# EAGLE design TeachingInstrument_front_panel_v3 (EAGLE 9.6.2)
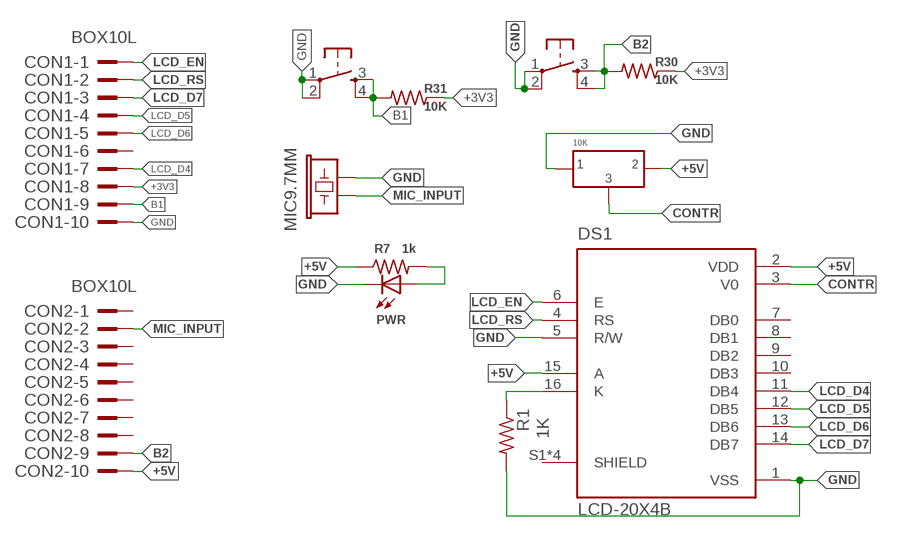
[diagram p0: schematic, sheet 1]

## Parts
CON1  BOX10L  [BOX10L]
CON2  BOX10L  [BOX10L]
DS1  LCD-20X4B  [LCD_LCD-20X4B]
PRESET  10K  PRESET_LR  [PRESET_LR]
PWR  LED3MM  [LED3MM]
R1  1K  R-US_0207/10  [0207/10]
R7  1k  R-US_0207/10  [0207/10]
R30  10K  R-US_0207/10  [0207/10]
R31  10K  R-US_0207/10  [0207/10]
U$1  OMRON_SWITCH_40-XX  [B3F-40XX]
U$2  OMRON_SWITCH_40-XX  [B3F-40XX]
U$12  MIC9.7MM  [MIC-9.7MM]

## Nets
+3V3: CON1.8 R30.1 R31.1
+5V [POWER]: CON2.10 DS1.2(VDD) DS1.15(A) PRESET.P$2 R7.1
B1: CON1.9 R31.2 U$1.3(S) U$1.4(S1)
B2: CON2.9 R30.2 U$2.3(S) U$2.4(S1)
CONTR: DS1.3(V0) PRESET.P$3
GND: CON1.10 DS1.1(VSS) DS1.5(R/W) PRESET.P$1 PWR.K(C) R1.2 U$1.1(P) U$1.2(P1) U$2.1(P) U$2.2(P1) U$12.2
LCD_D4: CON1.7 DS1.11(DB4)
LCD_D5: CON1.4 DS1.12(DB5)
LCD_D6: CON1.5 DS1.13(DB6)
LCD_D7: CON1.3 DS1.14(DB7)
LCD_EN: CON1.1 DS1.6(E)
LCD_RS: CON1.2 DS1.4(RS)
MIC_INPUT: CON2.2 U$12.1
N$2: DS1.16(K) R1.1
N$38: PWR.A R7.2
Unconnected: CON1.6 CON2.1 CON2.3 CON2.4 CON2.5 CON2.6 CON2.7 CON2.8 DS1.7(DB0) DS1.8(DB1) DS1.9(DB2) DS1.10(DB3) DS1.S1(SHIELD) DS1.S2(SHIELD) DS1.S3(SHIELD) DS1.S4(SHIELD)

## Library data of the parts
CON1 CON2 = CEDT_JANUARY_2015_v5:BOX10: 3M (TM) Pak 100 4-Wall Header Source: 3M
DS1 = LCD-20X4B:LCD-20X4B: Display Development Tools 20X4 CHARACTER BLUE LCD W/BACKLIGHT Check availability <https://pricing.snapeda.com/parts/LCD-20X4B/Gravitech/view-part?ref=eda>; AVAILABILITY: In Stock; DESCRIPTION: Display Development Tools 20X4 CHARACTER BLUE LCD W/BACKLIGHT; MF: Gravitech; MP: LCD-20X4B; PACKAGE: None; PRICE: None; PURCHASE-URL: https://pricing.snapeda.com/search/part/LCD-20X4B/?ref=eda
PRESET = CEDT_JANUARY_2015_v5:PRESET_LR
PWR = adafruit:LED: LED OSRAM: - CHIPLED LG R971, LG N971, LY N971, LG Q971, LY Q971, LO R971, LY R971 LH N974, LH R974 LS Q976, LO Q976, LY Q976 LO Q996 - Hyper CHIPLED LW Q18S LB Q993, LB Q99A, LB R99A - SideLED LS A670, LO A670, LY A670, LG A670, LP A670 LB A673, LV A673, LT A673, LW A673 LH A674 LY A675 LS A676, LA A676, LO A676, LY A676, LW A676 LS A679, LY A679, LG A679 - Hyper Micro SIDELED® LS Y876, LA Y876, LO Y876, LY Y876 LT Y87S - SmartLED LW L88C, LW L88S LB L89C, LB L89S, LG L890 LS L89K, LO L89K, LY L89K LS L896, LA L896, LO L896, LY L896 - TOPLED LS T670, LO T670, LY T670, LG T670, LP T670 LSG T670, LSP T670, LSY T670, LOP T670, LYG T670 LG T671, LOG T671, LSG T671 LB T673, LV T673, LT T673, LW T673 LH T674 LS T676, LA T676, LO T676, LY T676, LB T676, LH T676, LSB T676, LW T676 LB T67C, LV T67C, LT T67C, LS T67K, LO T67K, LY T67K, LW E67C LS E67B, LA E67B, LO E67B, LY E67B, LB E67C, LV E67C, LT E67C LW T67C LS T679, LY T679, LG T679 LS T770, LO T770, LY T770, LG T770, LP T770 LB T773, LV T773, LT T773, LW T773 LH T774 LS E675, LA E675, LY E675, LS T675 LS T776, LA T776, LO T776, LY T776, LB T776 LHGB T686 LT T68C, LB T68C - Hyper Mini TOPLED® LB M676 - Mini TOPLED Santana® LG M470 LS M47K, LO M47K, LY M47K Source: http://www.osram.convergy.de/
R1 = resistor:R-US_: RESISTOR, American symbol
R7 R30 R31 = rcl:R-US_: RESISTOR, American symbol
U$1 U$2 = CEDT_JANUARY_2015_v5:OMRON_SWITCH
U$12 = CEDT_JANUARY_2015_v5:MIC: Microphone Omni-directional electret microphone. 9.7mm standard diameter.

## Net classes
0 default: width 0.508 mm
1 POWER: width 0.61 mm, drill 0.7 mm, clearance 0.25 mm

## Board
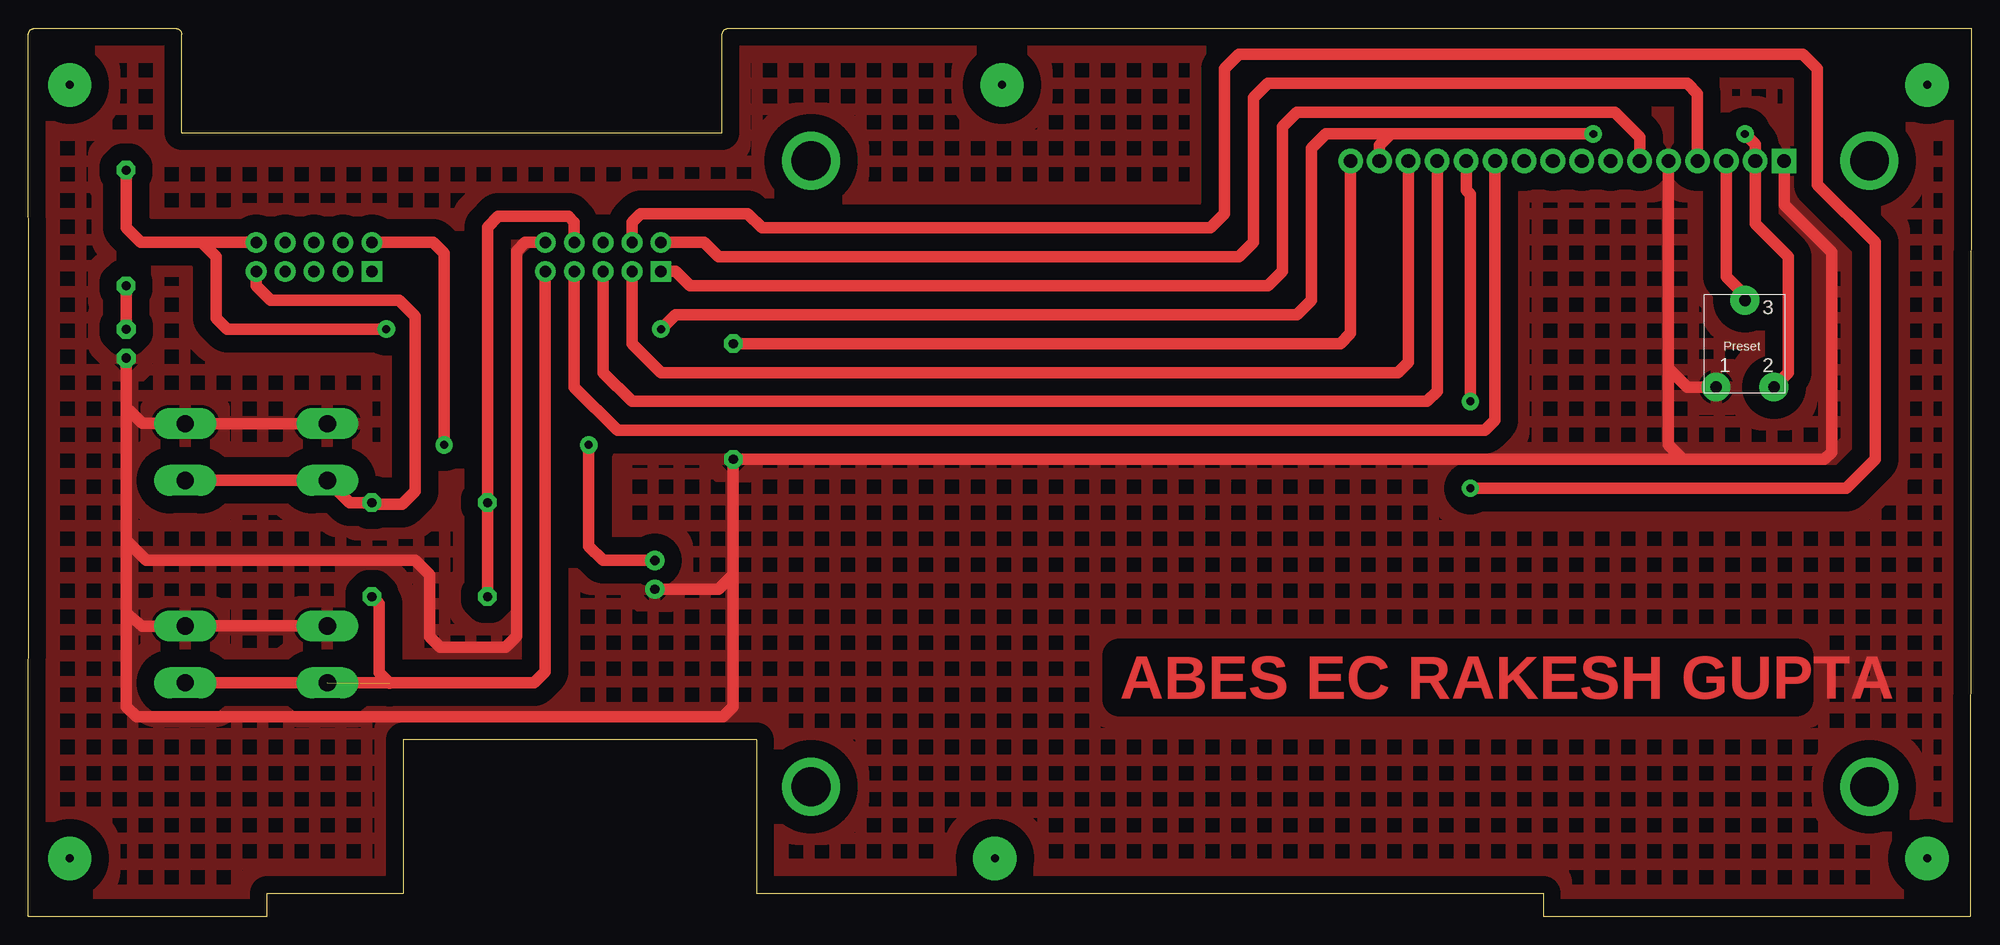
[diagram p1: board, top side]
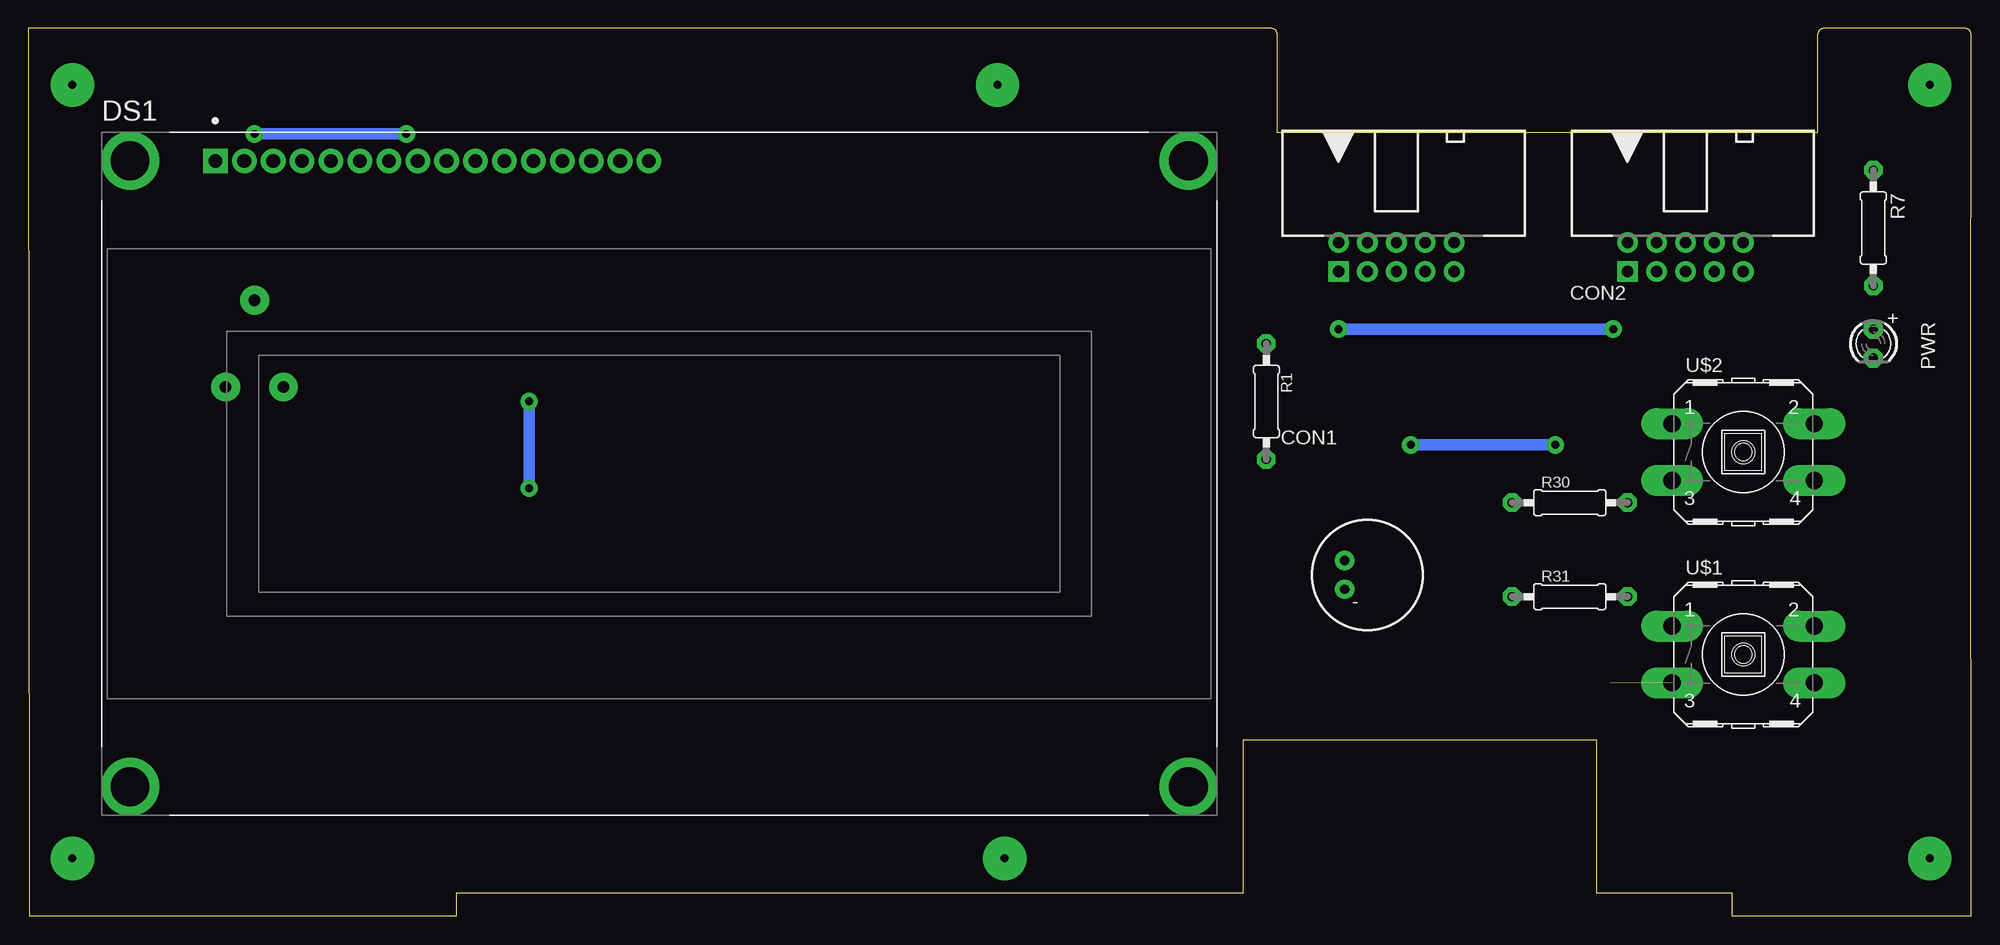
[diagram p2: board, bottom side, seen from below]

Size 170.69 x 77.98 mm. Coordinates in mm from the lower left corner, seen from the top.
Outline: 0,0 0.03,45.21 0,77.47 arc-90 0.51,77.98 12.95,77.98 arc-90 13.46,77.47 13.46,68.83 60.96,68.83 60.96,77.47 arc-90 61.47,77.98 170.69,77.98 170.64,0 133.1,0 133.1,2.01 63.96,2.01 63.96,15.51 32.94,15.51 32.94,2.01 20.98,2.01 20.98,0 0,0
Copper layers (1*16): Top 0.035mm / dielectric 1.5mm / Bottom 0.035mm
Design rules "default *": minimum track width 6mil, minimum drill 0.35mm, track to track 16mil, track to pad 16mil, pad to pad 10mil, via to via 16mil, smd to smd 16mil, copper to edge 40mil, drill to drill 6mil, minimum pad ring 16mil, minimum via ring 16mil, stop-mask expansion 4mil, vias tented up to drill 0mil, thermal gap 10mil

### Footprints (pad centres in the part's own frame; a part is rotated, then mirrored left to right if it is on the bottom)
BOX10L = drill 1 pad 1.422 square: 1 -5.08,-1.27 | drill 1 pad 1.422: 2 -5.08,1.27; 3 -2.54,-1.27; 4 -2.54,1.27; 5 0,-1.27; 6 0,1.27; 7 2.54,-1.27; 8 2.54,1.27; 9 5.08,-1.27; 10 5.08,1.27
LCD_LCD-20X4B = drill 1.2 pad 1.8 square: 1 -39,27.46 | drill 1.2 pad 1.8: 2 -36.46,27.46; 3 -33.92,27.46; 4 -31.38,27.46; 5 -28.84,27.46; 6 -26.3,27.46; 7 -23.76,27.46; 8 -21.22,27.46; 9 -18.68,27.46; 10 -16.14,27.46; 11 -13.6,27.46; 12 -11.06,27.46; 13 -8.52,27.46; 14 -5.98,27.46; 15 -3.44,27.46; 16 -0.9,27.46 | drill 3.4 pad 5.1: S1 -46.5,27.5; S2 46.5,27.5; S3 -46.5,-27.5; S4 46.5,-27.5
PRESET_LR = drill 1.016 pad 2.54: P$1 -2.54,-3.81; P$2 2.54,-3.81; P$3 0,3.81
LED3MM = drill 0.813 pad 1.676 octagon: A -1.27,0; K 1.27,0
0207/10 = drill 0.813 octagon: 1 -5.08,0; 2 5.08,0
B3F-40XX = drill 1.524 long: 1 -6.248,2.489; 2 6.248,2.489; 3 -6.248,-2.489; 4 6.248,-2.489
MIC-9.7MM = drill 0.8 pad 1.676: 1 -2,1.27; 2 -2,-1.27

### Placement (x,y rotation side)
CON1  50.5,57.91 0 bottom
CON2  25.1,57.91 0 bottom
DS1  115.27,38.86 0 bottom
PRESET  150.83,50.29 0 top
PWR  8.59,50.29 270 bottom
R1  61.93,45.21 270 bottom
R7  8.59,60.45 270 bottom
R30  35.26,36.32 0 bottom
R31  35.26,28.07 0 bottom
U$1  20.02,22.99 0 bottom
U$2  20.02,40.77 0 bottom
U$12  53.04,29.97 0 bottom

### Tracks (layer width: path | path; a pad name or v marks a point on that pad's centre or on a via)
+3V3
  Top 1.016: R31.1 R30.1 40.34,60.53 41.27,61.47 47.45,61.47 47.95,60.96 CON1.8
+5V  (via drill 0.7 pad 1.52)
  Top 1.016: PRESET.P$2 154.63,47.75 154.63,57.91 151.72,60.82 DS1.2 151.72,67.81 v150.82,68.71 | CON2.10 15.24,59.18 | 15.24,59.18 9.86,59.18 8.59,60.45 R7.1 | v137.49,68.71 119.71,68.71 | DS1.15 118.7,67.7 119.71,68.71 | 119.71,68.71 114,68.71 112.72,67.44 112.72,54.1 111.45,52.83 56.84,52.83 v55.58,51.56 | v31.45,51.56 17.48,51.56 16.51,52.53 16.51,57.91 15.24,59.18
  Bottom 1.016: v150.82,68.71 v137.49,68.71 | v31.45,51.56 v55.58,51.56
B1  (1 unrouted)
  Top 1.016: U$1.4 U$1.3 44.45,20.5 45.41,21.46 CON1.9 | R31.2 30.81,27.43 30.81,21.39 31.75,20.45
B2
  Top 1.016: U$2.4 U$2.3 28.22,36.32 R30.2 30.3,36.2 32.84,36.2 33.98,37.34 33.98,52.7 32.59,54.1 21.29,54.1 20.02,55.37 CON2.9
CONTR
  Top 1.016: PRESET.P$3 150.82,54.52 149.19,56.16 DS1.3
GND
  Top 1.016: 144.1,48.12 145.75,46.48 PRESET.P$1 | PWR.K 8.59,44.45 | 8.59,44.45 8.59,33.02 | 8.59,33.02 8.59,26.67 | U$2.1 U$2.2 13.72,43.31 9.98,43.31 8.84,44.45 8.59,44.45 | DS1.1 154.26,62.51 158.44,58.33 158.44,40.77 157.81,40.13 R1.2 61.92,29.97 | 144.1,48.12 144.1,41.4 145.38,40.13 | DS1.5 144.1,48.12 | 61.92,29.97 60.66,28.7 U$12.2 | 61.92,29.97 61.92,18.41 61.01,17.5 9.5,17.5 8.59,18.41 8.59,26.67 | 8.59,26.67 9.98,25.48 U$1.2 13.82,25.53 26.21,25.53 U$1.1 | 8.59,33.02 10.36,31.24 33.98,31.24 35.26,29.97 35.26,24.56 36.2,23.62 41.91,23.62 42.88,24.59 42.88,58.42 43.64,59.18 CON1.10
  pour Top (isolate 1.524, hatched): 171.27,78.74 -0.81,78.74 -0.81,-1.27 171.27,-1.27
LCD_D4
  Top 1.016: DS1.11 128.87,43.57 127.97,42.67 51.77,42.67 47.95,46.48 CON1.7
LCD_D5  (via drill 0.7 pad 1.52)
  Top 1.016: v126.69,37.59 159.72,37.59 162.25,40.13 162.25,59.18 157.18,64.26 157.18,74.42 155.91,75.69 106.38,75.69 105.11,74.42 105.11,61.72 103.83,60.45 64.47,60.45 63.2,61.72 53.8,61.72 53.03,60.96 CON1.4 | v126.69,45.21 126.69,63.41 126.33,63.78 DS1.12
  Bottom 1.016: v126.69,37.59 v126.69,45.21
LCD_D6
  Top 1.016: DS1.13 123.78,46.11 122.89,45.21 53.03,45.21 50.49,47.75 CON1.5
LCD_D7
  Top 1.016: DS1.14 121.25,48.65 120.34,47.75 55.58,47.75 53.03,50.29 CON1.3
LCD_EN
  Top 1.016: DS1.6 141.56,68.44 139.4,70.61 111.45,70.61 110.19,69.34 110.19,56.64 108.92,55.37 58.12,55.37 56.84,56.64 CON1.1
LCD_RS
  Top 1.016: DS1.4 146.65,72.25 145.75,73.15 108.92,73.15 107.64,71.88 107.64,59.18 106.38,57.91 60.66,57.91 59.38,59.18 CON1.2
MIC_INPUT  (via drill 0.7 pad 1.52)
  Top 1.016: v49.23,41.4 49.23,32.51 50.49,31.24 U$12.1 | CON2.2 35.56,59.18 36.52,58.22 v36.52,41.4
  Bottom 1.016: v49.23,41.4 v36.52,41.4
N$1  (via drill 0.7 pad 3.81)
  other vias: 166.83,73.03
N$2
  Top 1.016: DS1.16 116.17,51.19 115.27,50.29 R1.1
N$3  (via drill 0.7 pad 3.81)
  other vias: 166.83,5.08
N$4  (via drill 0.7 pad 3.81)
  other vias: 3.63,5.08
N$5  (via drill 0.7 pad 3.81)
  other vias: 3.63,73.03
N$6  (via drill 0.7 pad 3.81)
  other vias: 84.91,5.08
N$7  (via drill 0.7 pad 3.81)
  other vias: 85.55,73.03
N$38
  Top 1.016: R7.2 PWR.A

### Text on the board
Top: ABES EC RAKESH GUPTA